# Altium schematic sheet ADC.SchDoc: Set in Document Options » Parameters » Title
size Tabloid; Author: Set in Document Options » Parameters » Author + Contact info
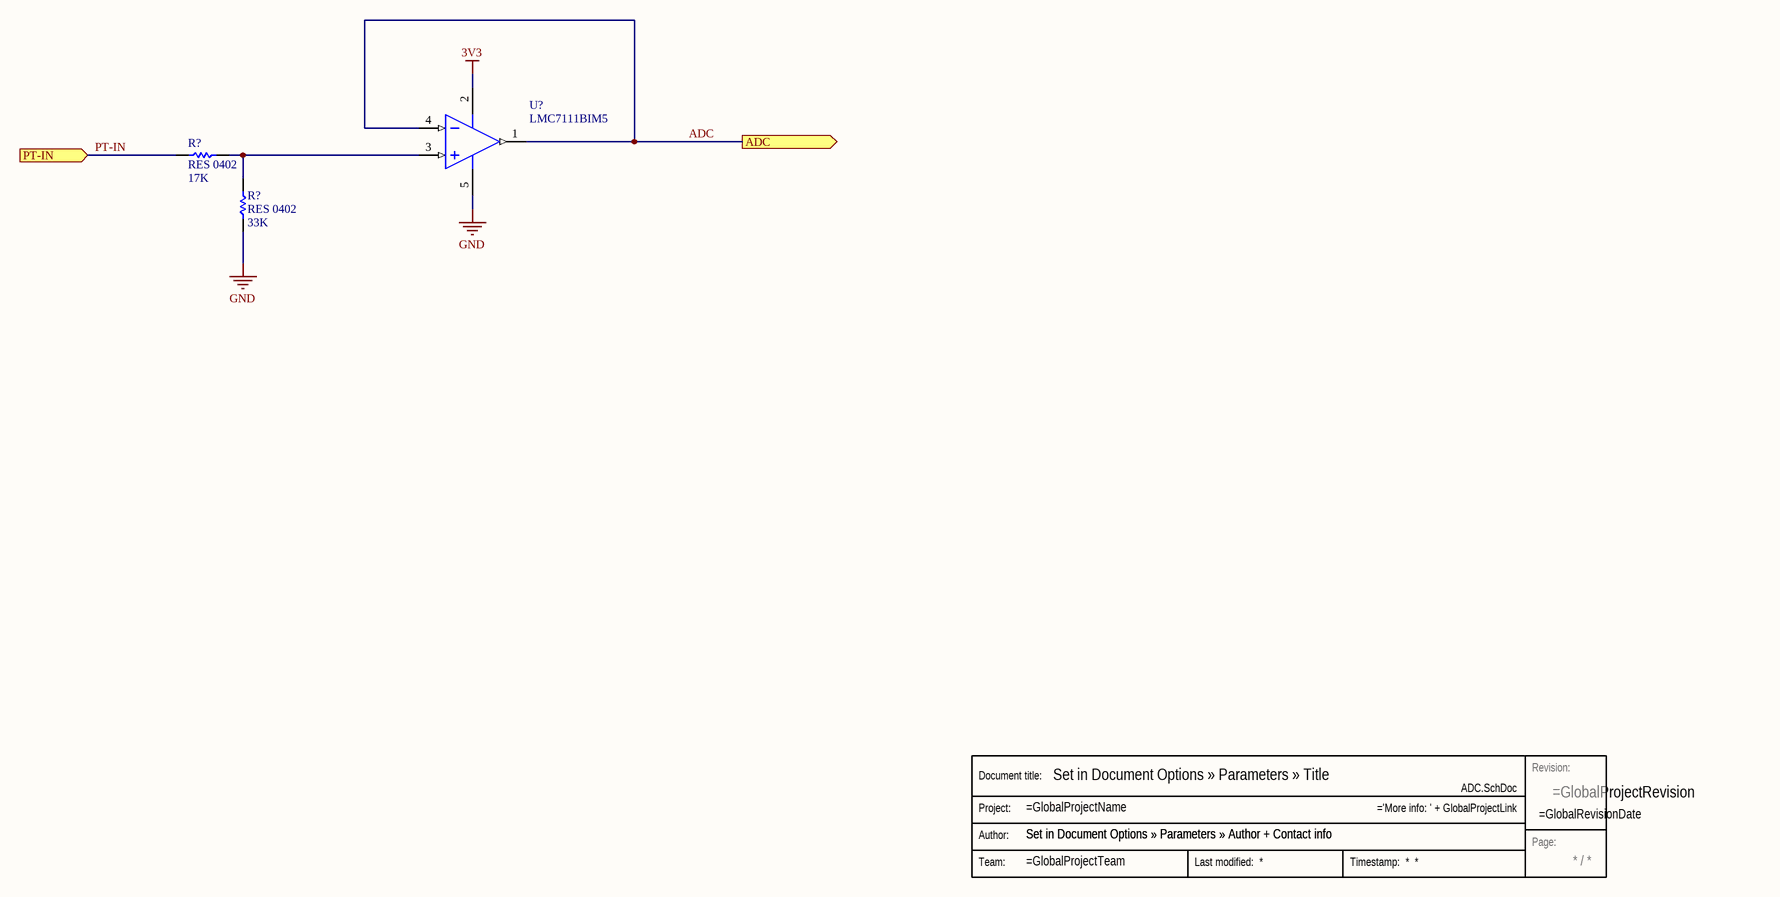
[diagram p0: ADC.SchDoc]

## Parts
(Parts that share a designator on the sheet are numbered #1, #2 ... from top to bottom, then left to right.)
R?#1  RES 0402  Value (Ohms): 17K  [RES 0402]
R?#2  RES 0402  Value (Ohms): 33K  [RES 0402]
Stamp  Stamp  (value not drawn)  (graphical)
U?  LMC7111BIM5  [MF05A_N]

## Ports
ADC (out), PT-IN (in)

## Nets
3V3: U?.2(V+)
GND: R?#2.1 U?.5(V-)
ADC: U?.1(OUT) U?.4(IN-) ; port ADC
PT-IN: R?#1.1 ; port PT-IN
NetR?#1_2: R?#1.2 R?#2.2 U?.3(IN+)

## Notes on the sheet
- (in symbol Stamp) Revision:; Document title:; Project:; Author:; Page:; Team:

## Library data of the parts
U? = LMC7111BIM5: Tiny CMOS Operational Amplifier with Rail-to-Rail Input and Output, 5-pin SOT-23; Manufacturer: National Semiconductor; PackageTopMarking: A01B*XTT; PowerWise: N; CompType: Amplifiers; High-Reliability: Y; DatasheetVersion: Jun-2006; PackageVersion: revD, Aug-2008; PackageReference: MF05A; PackageDescription: Molded SOT-23, .115 x .063 x .040 in Body, 5 Lead, .0375 in Pitch; PartNumber: LMC7111BIM5; RoHS: N; PinCount: 5; ComponentLink1Description: Manufacturer URL; ComponentLink1URL: http://www.national.com/; ComponentLink2Description: LMC7111 Datasheet; ComponentLink2URL: http://www.national.com/ds/LM/LMC7111.pdf; ComponentLink3Description: LMC7111 Web Page; ComponentLink3URL: http://www.national.com/pf/LM/LMC7111.html; ComponentLink4Description: MF05A Package Page; ComponentLink4URL: http://www.national.com/packaging/folders/mf05a.html
R?#1 R?#2 = RES 0402: PartNumber: *; Tolerance: *